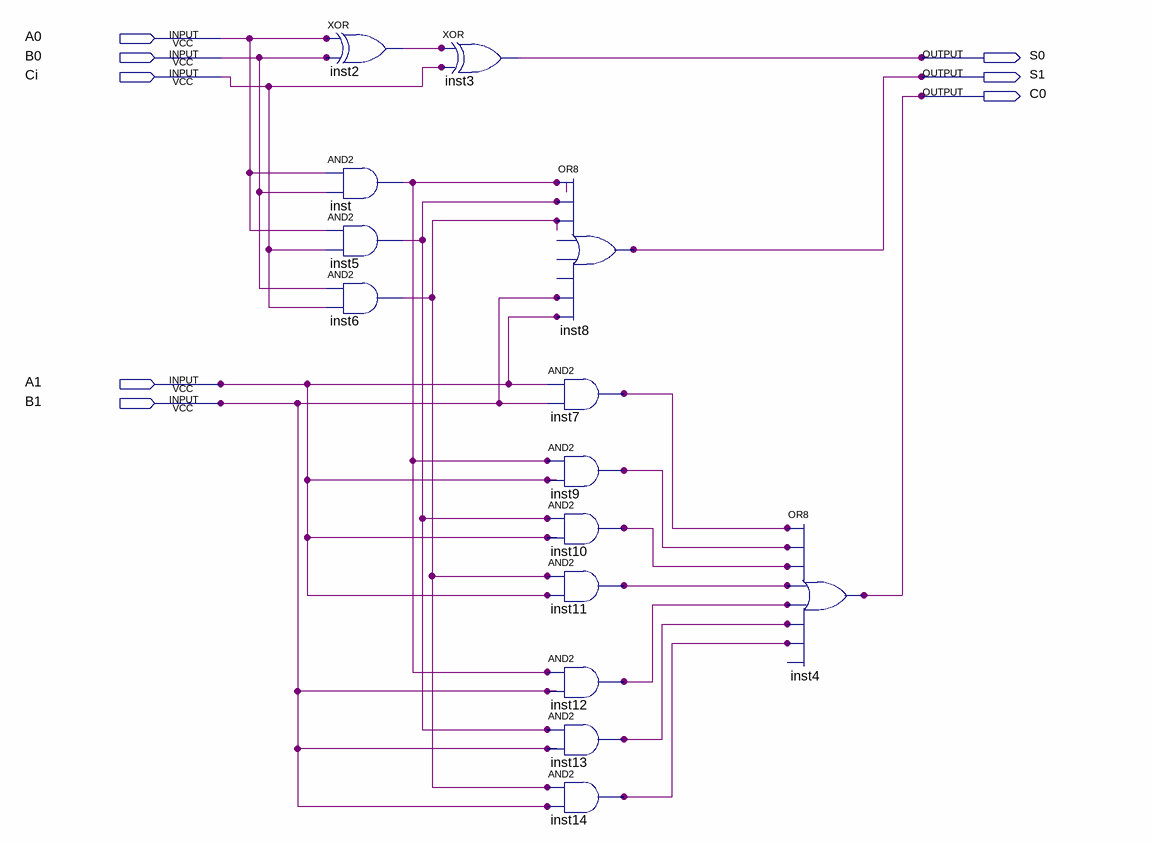
[diagram p0: schematic sheet]
// Quartus schematic HW1_P2.bdf as structural Verilog: 14 symbols, 8 pins
module HW1_P2 (
  input  A0,
  input  B0,
  input  Ci,
  input  A1,
  input  B1,
  output S0,
  output S1,
  output C0
);

  wire inst2_out, inst5_out, inst6_out, inst7_out, inst9_out, inst10_out, inst11_out, inst12_out, inst13_out,
       inst14_out, inst_out;

  xor inst2 (inst2_out, A0, B0);
  and inst (inst_out, A0, B0);
  and inst5 (inst5_out, A0, Ci);
  and inst6 (inst6_out, B0, Ci);
  xor inst3 (S0, inst2_out, Ci);
  or inst8 (S1, inst_out, inst5_out, inst6_out, B1, A1);  // open: IN4, IN5, IN6
  and inst7 (inst7_out, A1, B1);
  and inst9 (inst9_out, inst_out, A1);
  and inst10 (inst10_out, inst5_out, A1);
  and inst11 (inst11_out, inst6_out, A1);
  and inst12 (inst12_out, inst_out, B1);
  and inst13 (inst13_out, inst5_out, B1);
  and inst14 (inst14_out, inst6_out, B1);
  or inst4 (C0, inst7_out, inst9_out, inst10_out, inst11_out, inst12_out, inst13_out, inst14_out);  // open: IN8
endmodule
